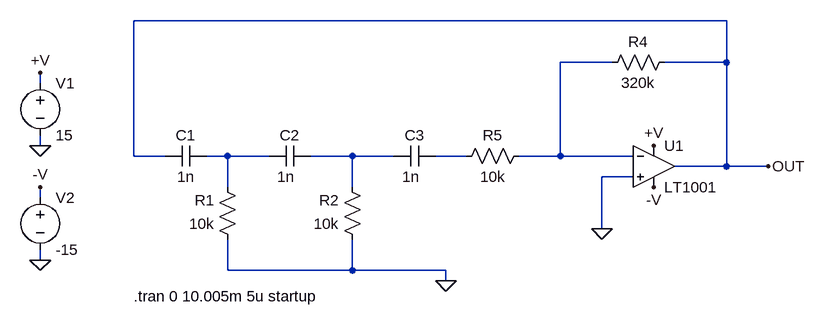
[diagram p0: schematic rc-phase-shift-oscillator.asc]
rc-phase-shift-oscillator.asc, the LTspice schematic file:
Version 4
SHEET 1 880 1108
WIRE 336 176 -576 176
WIRE 160 240 80 240
WIRE 336 240 336 176
WIRE 336 240 240 240
WIRE -720 272 -720 256
WIRE -720 368 -720 352
WIRE -576 384 -576 176
WIRE -528 384 -576 384
WIRE -432 384 -464 384
WIRE -368 384 -432 384
WIRE -240 384 -304 384
WIRE -176 384 -240 384
WIRE -64 384 -112 384
WIRE 80 384 80 240
WIRE 80 384 16 384
WIRE 192 384 80 384
WIRE 336 400 336 240
WIRE 336 400 256 400
WIRE 400 400 336 400
WIRE 192 416 144 416
WIRE -432 432 -432 384
WIRE -240 432 -240 384
WIRE -720 448 -720 432
WIRE 144 496 144 416
WIRE -720 544 -720 528
WIRE -432 560 -432 512
WIRE -240 560 -240 512
WIRE -240 560 -432 560
WIRE -96 560 -240 560
WIRE -96 576 -96 560
FLAG 224 368 +V
FLAG 224 432 -V
FLAG -720 256 +V
FLAG -720 544 0
FLAG -720 368 0
FLAG -720 432 -V
FLAG -96 576 0
FLAG 400 400 OUT
FLAG 144 496 0
SYMBOL voltage -720 256 R0
SYMATTR InstName V1
SYMATTR Value 15
SYMBOL voltage -720 432 R0
SYMATTR InstName V2
SYMATTR Value -15
SYMBOL res -416 528 R180
WINDOW 0 36 76 Left 2
WINDOW 3 36 40 Left 2
SYMATTR InstName R1
SYMATTR Value 10k
SYMBOL cap -304 368 R90
WINDOW 0 0 32 VBottom 2
WINDOW 3 32 38 VTop 2
SYMATTR InstName C2
SYMATTR Value 1n
SYMBOL opamps\\LT1001 224 336 R0
SYMATTR InstName U1
SYMBOL res -224 528 R180
WINDOW 0 36 76 Left 2
WINDOW 3 36 40 Left 2
SYMATTR InstName R2
SYMATTR Value 10k
SYMBOL cap -464 368 R90
WINDOW 0 0 32 VBottom 2
WINDOW 3 32 32 VTop 2
SYMATTR InstName C1
SYMATTR Value 1n
SYMBOL cap -112 368 R90
WINDOW 0 0 32 VBottom 2
WINDOW 3 32 38 VTop 2
SYMATTR InstName C3
SYMATTR Value 1n
SYMBOL res 144 256 R270
WINDOW 0 32 56 VTop 2
WINDOW 3 0 56 VBottom 2
SYMATTR InstName R4
SYMATTR Value 320k
SYMBOL res -80 400 R270
WINDOW 0 32 56 VTop 2
WINDOW 3 0 56 VBottom 2
SYMATTR InstName R5
SYMATTR Value 10k
TEXT -576 600 Left 2 !.tran 0 10.005m 5u startup

The netlist it stands for:
* rc-phase-shift-oscillator.asc
V1 +V 0 15
V2 -V 0 -15
R1 0 N002 10k
C2 N003 N002 1n
XU1 0 N001 +V -V OUT LT1001  ; pins In+ In- V+ V- OUT
R2 0 N003 10k
C1 N002 OUT 1n
C3 N004 N003 1n
R4 N001 OUT 320k
R5 N004 N001 10k
.tran 0 10.005m 5u startup
.lib LTC.lib
.backanno
.end